# EAGLE design Board_V03 (EAGLE 9.3.0)
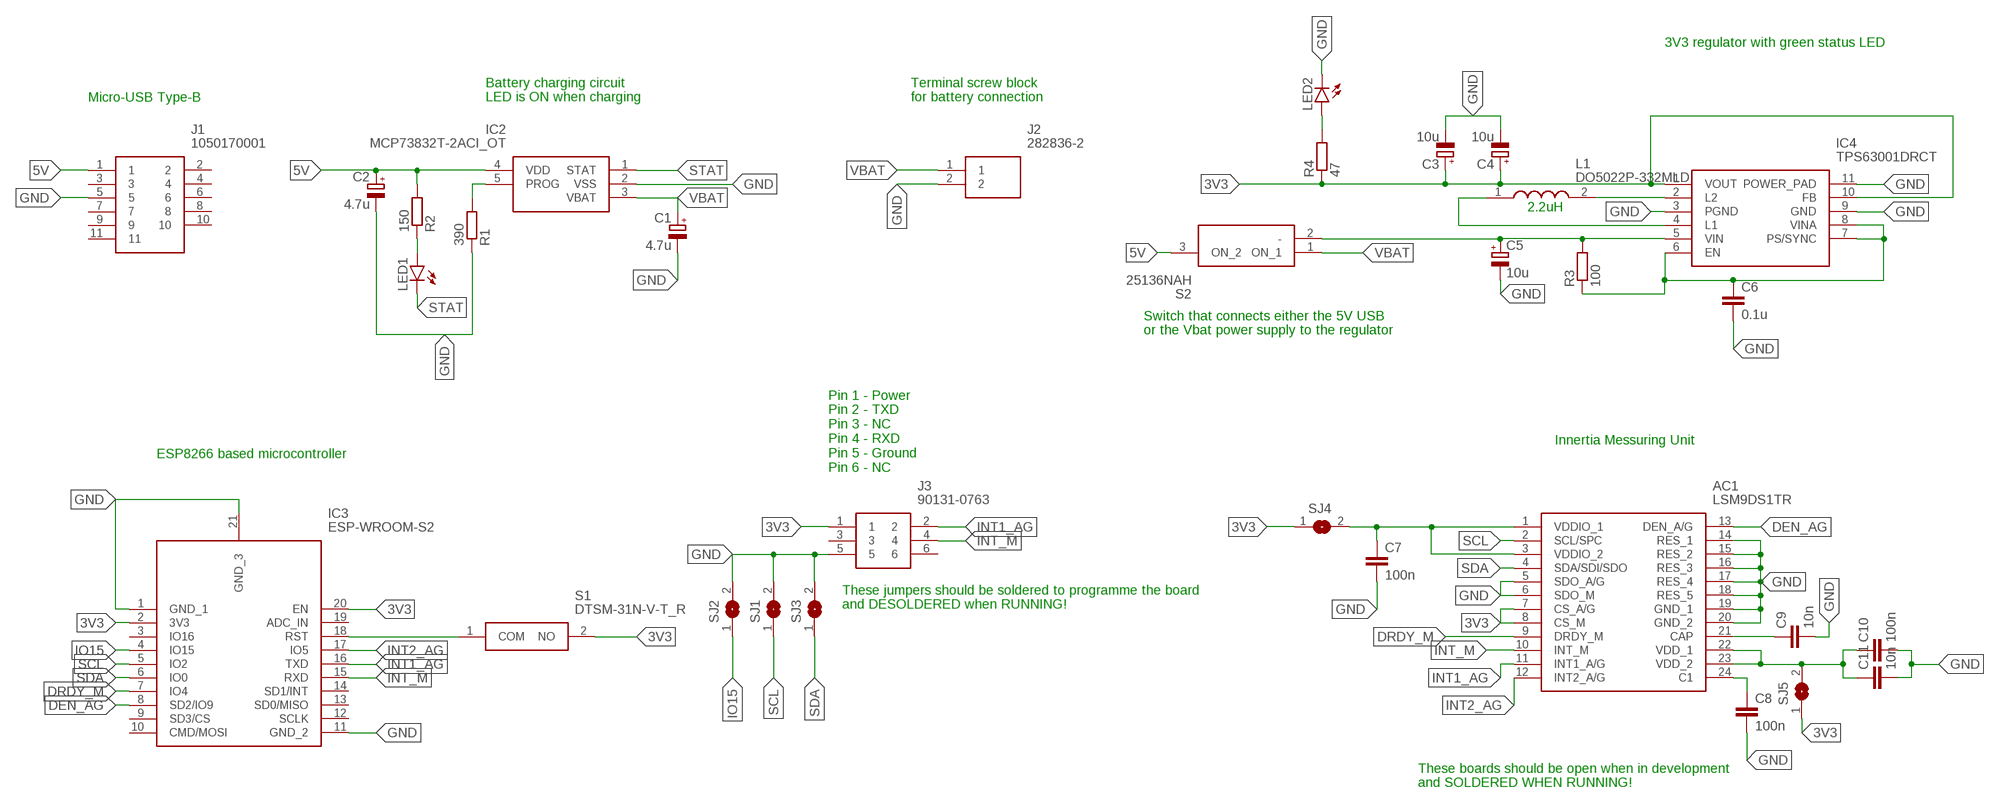
[diagram p0: schematic, sheet 1]

## Parts
AC1  LSM9DS1TR  [LGA-24L(3X3.5X1MM)]
C1  4.7u  CPOL-EUD/7343-31R  [D/7343-31R]
C2  4.7u  CPOL-EUD/7343-31R  [D/7343-31R]
C3  10u  CPOL-EUD/7343-31R  [D/7343-31R]
C4  10u  CPOL-EUD/7343-31R  [D/7343-31R]
C5  10u  CPOL-EUD/7343-31R  [D/7343-31R]
C6  0.1u  C-EUC0402  [C0402]
C7  100n  C-EUC0805  [C0805]
C8  100n  C-EUC0805  [C0805]
C9  10n  C-EUC0805  [C0805]
C10  100n  C-EUC0805  [C0805]
C11  10n  C-EUC0805  [C0805]
IC2  MCP73832T-2ACI_OT  [SOT95P270X145-5N]
IC3  ESP-WROOM-S2  [QFN150P1600X1700X315-21N]
IC4  TPS63001DRCT  [SON50P300X300X100-11N]
J1  1050170001  [MICROUSB-BTYPE]
J2  282836-2  [SHDR2W100P0X500_1X2_1000X820X1]
J3  90131-0763  [HDRV6W90P254_2X3_762X500X560P]
L1  DO5022P-332MLD  [DO5022P-104MLD]
LED1  LED5MM  [LED5MM]
LED2  LED5MM  [LED5MM]
R1  390  R-EU_R0805  [R0805]
R2  150  R-EU_R0805  [R0805]
R3  100  R-EU_R0805  [R0805]
R4  47  R-EU_R0805  [R0805]
S1  DTSM-31N-V-T_R  [DTSM32NVTR]
S2  25136NAH  [25136NAH]
SJ1  SJW  [SJW]
SJ2  SJW  [SJW]
SJ3  SJW  [SJW]
SJ4  SJW  [SJW]
SJ5  SJW  [SJW]

## Nets
3V3 [power]: AC1.7(CS_A/G) AC1.8(CS_M) C3.+ C4.+ IC3.2(3V3) IC3.20(EN) IC4.1(VOUT) IC4.10(FB) J3.1 R4.1 S1.2(NO) SJ4.1 SJ5.1
5V [power]: C2.+ IC2.4(VDD) J1.1 R2.2 S2.3(ON_2)
DEN_AG: AC1.13(DEN_A/G) IC3.8(SD2/IO9)
DRDY_M: AC1.9(DRDY_M) IC3.7(IO4)
GND [ground]: AC1.5(SDO_A/G) AC1.6(SDO_M) AC1.14(RES_1) AC1.15(RES_2) AC1.16(RES_3) AC1.17(RES_4) AC1.18(RES_5) AC1.19(GND_1) AC1.20(GND_2) C1.- C2.- C3.- C4.- C5.- C6.2 C7.2 C8.2 C9.2 C10.2 C11.2 IC2.2(VSS) IC3.1(GND_1) IC3.11(GND_2) IC3.21(GND_3) IC4.3(PGND) IC4.9(GND) IC4.11(POWER_PAD) J1.5 J2.2 J3.5 LED2.K(C) R1.1 SJ1.2 SJ2.2 SJ3.2
INT1_AG: AC1.11(INT1_A/G) IC3.16(TXD) J3.2
INT2_AG: AC1.12(INT2_A/G) IC3.17(IO5)
INT_M: AC1.10(INT_M) IC3.15(RXD) J3.4
IO15: IC3.4(IO15) SJ2.1
N$1: IC2.5(PROG) R1.2
N$2: LED1.A R2.1
N$3: AC1.21(CAP) C9.1
N$4: C5.+ IC4.5(VIN) R3.2 S2.2(-)
N$5: LED2.A R4.2
N$6: AC1.1(VDDIO_1) AC1.3(VDDIO_2) C7.1 SJ4.2
N$7: IC4.2(L2) L1.2
N$8 [thin]: IC4.4(L1) L1.1
N$9: AC1.22(VDD_1) AC1.23(VDD_2) C10.1 C11.1 SJ5.2
N$10: C6.1 IC4.6(EN) IC4.7(PS/SYNC) IC4.8(VINA) R3.1
N$11: AC1.24(C1) C8.1
N$12: IC3.18(RST) S1.1(COM)
SCL: AC1.2(SCL/SPC) IC3.5(IO2) SJ1.1
SDA: AC1.4(SDA/SDI/SDO) IC3.6(IO0) SJ3.1
STAT: IC2.1(STAT) LED1.K(C)
VBAT: C1.+ IC2.3(VBAT) J2.1 S2.1(ON_1)
Unconnected: IC3.3(IO16) IC3.9(SD3/CS) IC3.10(CMD/MOSI) IC3.12(SCLK) IC3.13(SD0/MISO) IC3.14(SD1/INT) IC3.19(ADC_IN) J1.2 J1.3 J1.4 J1.6 J1.7 J1.8 J1.9 J1.10 J1.11 J3.3 J3.6

## Notes on the sheet
- 3V3 regulator with green status LED
- Micro-USB Type-B
- Battery charging circuit
  LED is ON when charging
- Terminal screw block 
  for battery connection
- 2.2uH
- Switch that connects either the 5V USB
  or the Vbat power supply to the regulator
- Innertia Messuring Unit
- ESP8266 based microcontroller
- Pin 1 - Power
  Pin 2 - TXD
  Pin 3 - NC
  Pin 4 - RXD
  Pin 5 - Ground
  Pin 6 - NC
- These jumpers should be soldered to programme the board
  and DESOLDERED when RUNNING!
- These boards should be open when in development
  and SOLDERED WHEN RUNNING!

## Library data of the parts
AC1 = SamacSys_Parts:LSM9DS1TR: iNEMO Inertial 3D Accel/Gyro/Magn. LGA24 STMicroelectronics LSM9DS1TR 3-Axis Accelerometer, Gyroscope & Magnetometer, 0 400 kHz, 1.9 3.6 V Source: Datasheet <http://www.st.com/content/ccc/resource/technical/document/datasheet/1e/3f/2a/d6/25/eb/48/46/DM00103319.pdf/files/DM00103319.pdf/jcr:content/translations/en.DM00103319.pdf>; DESCRIPTION: iNEMO Inertial 3D Accel/Gyro/Magn. LGA24 STMicroelectronics LSM9DS1TR 3-Axis Accelerometer, Gyroscope & Magnetometer, 0 400 kHz, 1.9 3.6 V; HEIGHT: mm; MANUFACTURER_NAME: STMicroelectronics; MANUFACTURER_PART_NUMBER: LSM9DS1TR; MOUSER_PART_NUMBER: 511-LSM9DS1TR; MOUSER_PRICE-STOCK: https://www.mouser.com/Search/Refine.aspx?Keyword=511-LSM9DS1TR; RS_PART_NUMBER: 1660908; RS_PRICE-STOCK: http://uk.rs-online.com/web/p/products/1660908
C1-C5 = rcl:CPOL-EU: POLARIZED CAPACITOR, European symbol; SPICEPREFIX: C
C6-C11 = rcl:C-EU: CAPACITOR, European symbol; SPICEPREFIX: C
IC2 = SamacSys_Parts:MCP73832T-2ACI_OT: Battery Charger Lithium-Ion, Lithium-Polymer Source: Datasheet <http://docs-emea.rs-online.com/webdocs/1381/0900766b81381752.pdf>; ALLIED_NUMBER: 70046199; ALLIED_PRICE-STOCK: http://www.alliedelec.com/microchip-technology-inc-mcp73832t-2aci-ot/70046199/; DESCRIPTION: Battery Charger Lithium-Ion, Lithium-Polymer; HEIGHT: 1.45mm; MANUFACTURER_NAME: Microchip; MANUFACTURER_PART_NUMBER: MCP73832T-2ACI/OT; MOUSER_PART_NUMBER: 579-MCP73832T-2ACIOT; MOUSER_PRICE-STOCK: https://www.mouser.com/Search/Refine.aspx?Keyword=579-MCP73832T-2ACIOT; RS_PART_NUMBER: 9122897; RS_PRICE-STOCK: http://uk.rs-online.com/web/p/products/9122897
IC3 = SamacSys_Parts:ESP-WROOM-S2: WiFi Modules (802.11) ESP-WROOM-S2, SMD Module, ESP8266EX, 16Mbits SPI Flash, SPI Mode Source: Datasheet <https://docs-emea.rs-online.com/webdocs/15b7/0900766b815b7223.pdf>; DESCRIPTION: WiFi Modules (802.11) ESP-WROOM-S2, SMD Module, ESP8266EX, 16Mbits SPI Flash, SPI Mode; HEIGHT: 3.15mm; MANUFACTURER_NAME: Espressif Systems; MANUFACTURER_PART_NUMBER: ESP-WROOM-S2
IC4 = SamacSys_Parts:TPS63001DRCT: 96% Buck-Boost Converter with 1.7A Current Switches, 3.3V fixed Output voltage in 3x3 QFN Source: Datasheet <http://uk.rs-online.com/web/p/products/7968405>; DESCRIPTION: 96% Buck-Boost Converter with 1.7A Current Switches, 3.3V fixed Output voltage in 3x3 QFN; HEIGHT: mm; MANUFACTURER_NAME: Texas Instruments; MANUFACTURER_PART_NUMBER: TPS63001DRCT; RS_PART_NUMBER: 7968405
J1 = SamacSys_Parts:1050170001: USB Connectors MICRO USB B REC RA SMT BOT Source: Datasheet <http://www.mouser.com/ds/2/276/1050170001_IO_CONNECTORS-230168.pdf>; DESCRIPTION: USB Connectors MICRO USB B REC RA SMT BOT; HEIGHT: mm; MANUFACTURER_NAME: Molex; MANUFACTURER_PART_NUMBER: 1050170001; MOUSER_PART_NUMBER: N/A; MOUSER_PRICE-STOCK: https://www.mouser.com/Search/Refine.aspx?Keyword=N%2FA
J2 = SamacSys_Parts:282836-2: TERMINAL BLOCK, PCB MOUNT, SIDE WIRE ENTRY, STACKING , 5.00mm PITCH Source: Datasheet <http://www.te.com/commerce/DocumentDelivery/DDEController?Action=srchrtrv&DocNm=282836&DocType=Customer Drawing&DocLang=English>; ALLIED_NUMBER: 70086275; ALLIED_PRICE-STOCK: https://www.alliedelec.com/te-connectivity-282836-2/70086275/; DESCRIPTION: TERMINAL BLOCK, PCB MOUNT, SIDE WIRE ENTRY, STACKING , 5.00mm PITCH; HEIGHT: 10.2mm; MANUFACTURER_NAME: TE Connectivity; MANUFACTURER_PART_NUMBER: 282836-2; MOUSER_PART_NUMBER: 571-2828362; MOUSER_PRICE-STOCK: https://www.mouser.com/Search/Refine.aspx?Keyword=571-2828362; RS_PART_NUMBER: 1354983; RS_PRICE-STOCK: http://uk.rs-online.com/web/p/products/1354983
J3 = SamacSys_Parts:90131-0763: Molex C-GRID III 90131, 2.54mm Pitch, 6 Way, 2 Row, Straight Pin Header, Through Hole Source: Datasheet <https://www.molex.com/pdm_docs/sd/901310763_sd.pdf>; ALLIED_NUMBER: 70372847; ALLIED_PRICE-STOCK: https://www.alliedelec.com/molex-incorporated-90131-0763/70372847/; DESCRIPTION: Molex C-GRID III 90131, 2.54mm Pitch, 6 Way, 2 Row, Straight Pin Header, Through Hole; HEIGHT: 5.6mm; MANUFACTURER_NAME: Molex; MANUFACTURER_PART_NUMBER: 90131-0763; MOUSER_PART_NUMBER: 538-90131-0763; MOUSER_PRICE-STOCK: https://www.mouser.com/Search/Refine.aspx?Keyword=538-90131-0763; RS_PART_NUMBER: 3606443P; RS_PRICE-STOCK: http://uk.rs-online.com/web/p/products/3606443P
L1 = SamacSys_Parts:DO5022P-332MLD: Fixed Inductors DO5022P Pwr Inductor 3.3 uH 20 % 6.2 A Source: Datasheet <https://www.coilcraft.com/pdfs/do5022p.pdf>; DESCRIPTION: Fixed Inductors DO5022P Pwr Inductor 3.3 uH 20 % 6.2 A; HEIGHT: mm; MANUFACTURER_NAME: COILCRAFT; MANUFACTURER_PART_NUMBER: DO5022P-332MLD; MOUSER_PART_NUMBER: 994-DO5022P-332MLD; MOUSER_PRICE-STOCK: https://www.mouser.com/Search/Refine.aspx?Keyword=994-DO5022P-332MLD
LED1 LED2 = led:LED: LED OSRAM: - CHIPLED LG R971, LG N971, LY N971, LG Q971, LY Q971, LO R971, LY R971 LH N974, LH R974 LS Q976, LO Q976, LY Q976 LO Q996 - Hyper CHIPLED LW Q18S LB Q993, LB Q99A, LB R99A - SideLED LS A670, LO A670, LY A670, LG A670, LP A670 LB A673, LV A673, LT A673, LW A673 LH A674 LY A675 LS A676, LA A676, LO A676, LY A676, LW A676 LS A679, LY A679, LG A679 - Hyper Micro SIDELED® LS Y876, LA Y876, LO Y876, LY Y876 LT Y87S - SmartLED LW L88C, LW L88S LB L89C, LB L89S, LG L890 LS L89K, LO L89K, LY L89K LS L896, LA L896, LO L896, LY L896 - TOPLED LS T670, LO T670, LY T670, LG T670, LP T670 LSG T670, LSP T670, LSY T670, LOP T670, LYG T670 LG T671, LOG T671, LSG T671 LB T673, LV T673, LT T673, LW T673 LH T674 LS T676, LA T676, LO T676, LY T676, LB T676, LH T676, LSB T676, LW T676 LB T67C, LV T67C, LT T67C, LS T67K, LO T67K, LY T67K, LW E67C LS E67B, LA E67B, LO E67B, LY E67B, LB E67C, LV E67C, LT E67C LW T67C LS T679, LY T679, LG T679 LS T770, LO T770, LY T770, LG T770, LP T770 LB T773, LV T773, LT T773, LW T773 LH T774 LS E675, LA E675, LY E675, LS T675 LS T776, LA T776, LO T776, LY T776, LB T776 LHGB T686 LT T68C, LB T68C - Hyper Mini TOPLED® LB M676 - Mini TOPLED Santana® LG M470 LS M47K, LO M47K, LY M47K Source: http://www.osram.convergy.de LUXEON: - LUMILED® LXK2-PW12-R00, LXK2-PW12-S00, LXK2-PW14-U00, LXK2-PW14-V00 LXK2-PM12-R00, LXK2-PM12-S00, LXK2-PM14-U00 LXK2-PE12-Q00, LXK2-PE12-R00, LXK2-PE12-S00, LXK2-PE14-T00, LXK2-PE14-U00 LXK2-PB12-K00, LXK2-PB12-L00, LXK2-PB12-M00, LXK2-PB14-N00, LXK2-PB14-P00, LXK2-PB14-Q00 LXK2-PR12-L00, LXK2-PR12-M00, LXK2-PR14-Q00, LXK2-PR14-R00 LXK2-PD12-Q00, LXK2-PD12-R00, LXK2-PD12-S00 LXK2-PH12-R00, LXK2-PH12-S00 LXK2-PL12-P00, LXK2-PL12-Q00, LXK2-PL12-R00 Source: www.luxeon.com KINGBRIGHT: KA-3528ASYC Source: www.kingbright.com
R1-R4 = rcl:R-EU_: RESISTOR, European symbol; SPICEPREFIX: R
S1 = SamacSys_Parts:DTSM-31N-V-T_R: Tactile Switches SMT Type 3.5*6 Source: Datasheet <http://www.dip.com.tw/en/en-product-information/en-switch004/item/2444-dts-3-dtsm-l-3>; DESCRIPTION: Tactile Switches SMT Type 3.5*6; HEIGHT: 5mm; MANUFACTURER_NAME: Diptronics; MANUFACTURER_PART_NUMBER: DTSM-31N-V-T/R; MOUSER_PART_NUMBER: 113-DTSM31NVTR; MOUSER_PRICE-STOCK: https://www.mouser.com/Search/Refine.aspx?Keyword=113-DTSM31NVTR
S2 = SamacSys_Parts:25136NAH: PCB Slide Switch SPDT On-On 4 A@ 125 V ac Slide Source: Datasheet <https://www.apem.com/int/index.php?controller=attachment&id_attachment=858>; DESCRIPTION: PCB Slide Switch SPDT On-On 4 A@ 125 V ac Slide; HEIGHT: 8mm; MANUFACTURER_NAME: Apem; MANUFACTURER_PART_NUMBER: 25136NAH; MOUSER_PART_NUMBER: 642-25136NAH; MOUSER_PRICE-STOCK: https://www.mouser.com/Search/Refine.aspx?Keyword=642-25136NAH; RS_PART_NUMBER: 0339673A; RS_PRICE-STOCK: http://uk.rs-online.com/web/p/products/0339673A
SJ1-SJ5 = jumper:SJ: SMD solder JUMPER

## Net classes
0 default: width 0.406 mm, clearance 0.205 mm
1 ground: width 0.61 mm, clearance 0.205 mm to class 0, clearance 0.205 mm
2 power: width 0.508 mm, clearance 0.205 mm to class 0, clearance 0.205 mm to class 1, clearance 0.205 mm
3 thin: width 0.305 mm, clearance 0.205 mm to class 0, clearance 0.205 mm to class 1, clearance 0.205 mm to class 2, clearance 0.205 mm

## Board
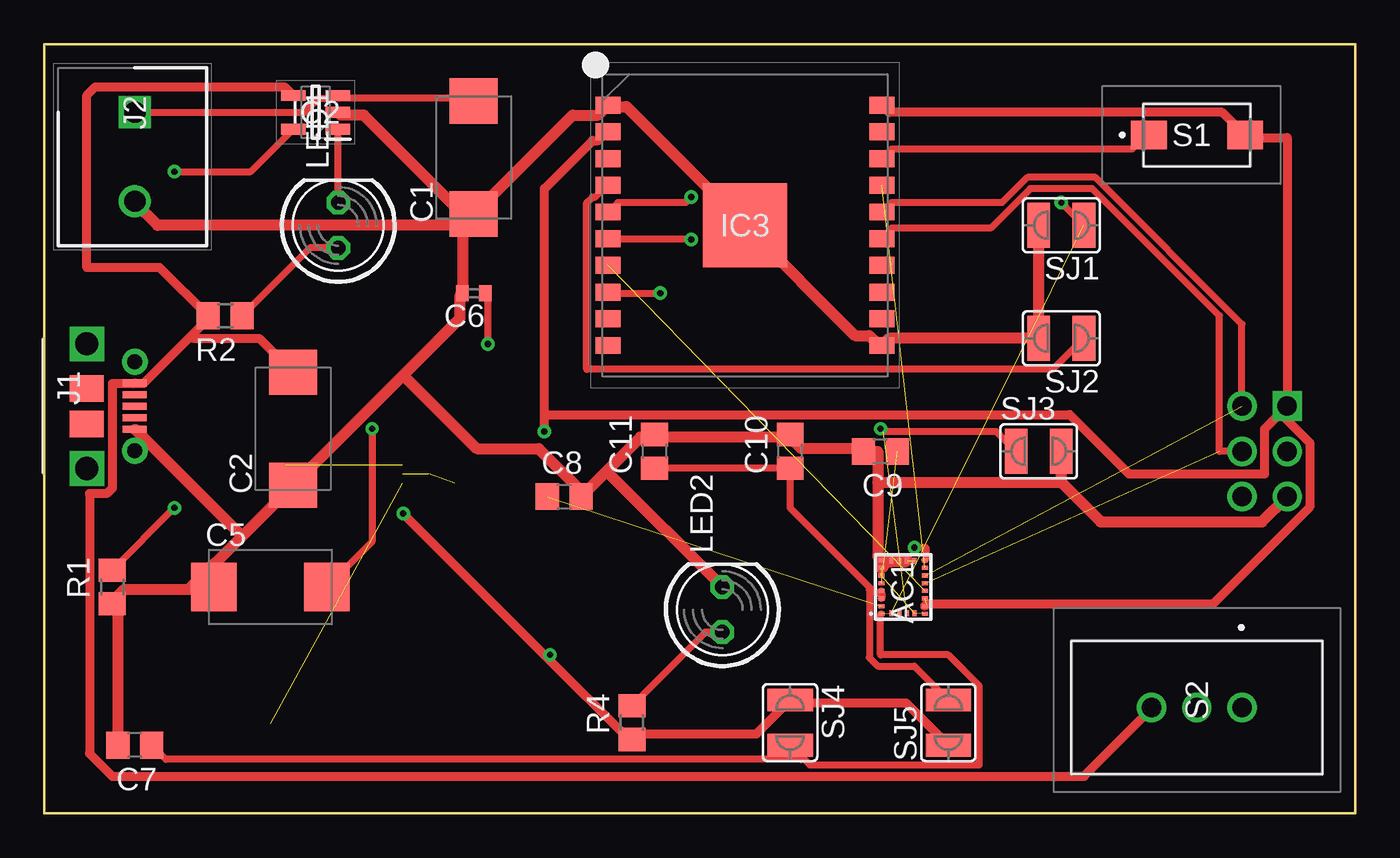
[diagram p1: board, top side]
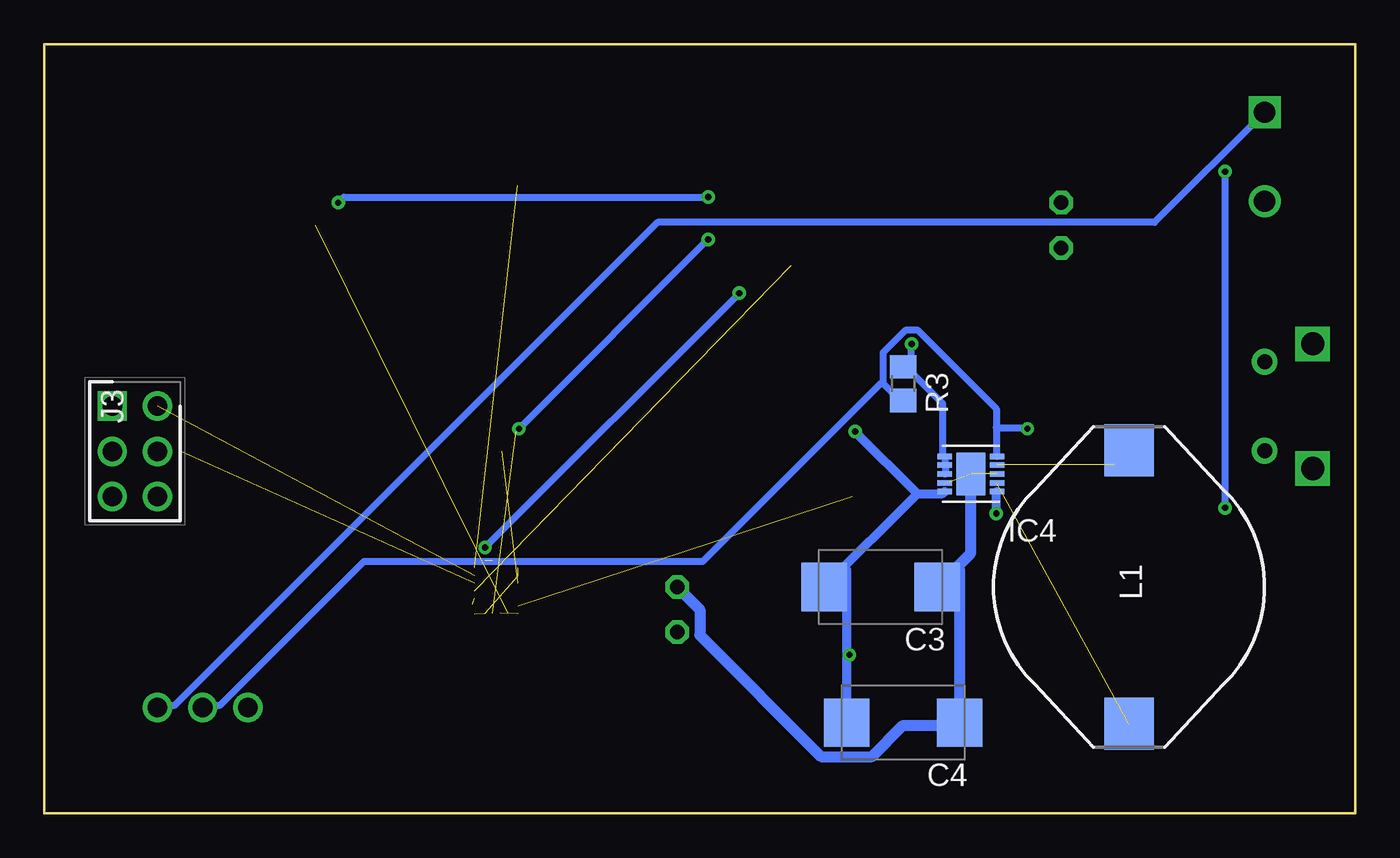
[diagram p2: board, bottom side, seen from below]

Size 73.66 x 43.18 mm. Coordinates in mm from the lower left corner, seen from the top.
Outline: 0,0 0,43.18 73.66,43.18 73.66,0 0,0
Copper layers (1*16): Top 0.035mm / dielectric 1.5mm / Bottom 0.035mm
Design rules "default": minimum track width 6mil, minimum drill 0.35mm, track to track 6mil, track to pad 6mil, pad to pad 6mil, via to via 6mil, smd to smd 6mil, copper to edge 40mil, drill to drill 6mil, minimum pad ring 10mil, minimum via ring 8mil, stop-mask expansion 4mil, vias tented up to drill 0mil, thermal gap 10mil

### Footprints (pad centres in the part's own frame; a part is rotated, then mirrored left to right if it is on the bottom)
LGA-24L(3X3.5X1MM) = smd 0.23 x 0.35: 1 -1.505,1.225; 6 -1.505,-1.225; 7 -1.075,-1.225; 8 -0.645,-1.225; 9 -0.215,-1.225; 10 0.215,-1.225; 11 0.645,-1.225; 12 1.075,-1.225; 13 1.505,-1.225; 18 1.505,1.225; 19 1.075,1.225; 20 0.645,1.225; 21 0.215,1.225; 22 -0.215,1.225; 23 -0.645,1.225; 24 -1.075,1.225 | smd 0.35 x 0.23: 2 -1.475,0.645; 3 -1.475,0.215; 4 -1.475,-0.215; 5 -1.475,-0.645; 14 1.475,-0.645; 15 1.475,-0.215; 16 1.475,0.215; 17 1.475,0.645
D/7343-31R = smd 2.55 x 2.7: + 3.175,0; - -3.175,0
C0402 = smd 0.7 x 0.9: 1 -0.65,0; 2 0.65,0
C0805 = smd 1.3 x 1.5: 1 -0.95,0; 2 0.95,0
SOT95P270X145-5N = smd 1.4 x 0.6: 1 -1.25,0.95; 2 -1.25,0; 3 -1.25,-0.95; 4 1.25,-0.95; 5 1.25,0.95
QFN150P1600X1700X315-21N = smd 1.4 x 0.95: 1 -7.7,6.75; 2 -7.7,5.25; 3 -7.7,3.75; 4 -7.7,2.25; 5 -7.7,0.75; 6 -7.7,-0.75; 7 -7.7,-2.25; 8 -7.7,-3.75; 9 -7.7,-5.25; 10 -7.7,-6.75; 11 7.7,-6.75; 12 7.7,-5.25; 13 7.7,-3.75; 14 7.7,-2.25; 15 7.7,-0.75; 16 7.7,0.75; 17 7.7,2.25; 18 7.7,3.75; 19 7.7,5.25; 20 7.7,6.75 | smd 4.7 x 4.7: 21 0,0
SON50P300X300X100-11N = smd 0.813 x 0.305: 1 -1.473,0.991; 2 -1.473,0.508; 3 -1.473,0; 4 -1.473,-0.508; 5 -1.473,-0.991; 6 1.473,-0.991; 7 1.473,-0.508; 8 1.473,0; 9 1.473,0.508; 10 1.473,0.991 | smd 1.651 x 2.388: 11 0,0
MICROUSB-BTYPE = smd 0.4 x 1.35: 1 -1.3,0; 2 -0.65,0; 3 0,0; 4 0.65,0; 5 1.3,0 | drill 0.85 pad 1.45: 6 -2.5,0; 7 2.5,0 | drill 1.3 pad 1.9 square: 8 -3.5,-2.7; 9 3.5,-2.7 | smd 1.5 x 1.9: 10 -1,-2.7; 11 1,-2.7
SHDR2W100P0X500_1X2_1000X820X1 = drill 1.2 pad 1.8 square: 1 0,0 | drill 1.2 pad 1.8: 2 5,0
HDRV6W90P254_2X3_762X500X560P = drill 1.1 pad 1.65 square: 1 0,0 | drill 1.1 pad 1.65: 2 0,2.54; 3 2.54,0; 4 2.54,2.54; 5 5.08,0; 6 5.08,2.54
DO5022P-104MLD = smd 2.92 x 2.79: 1 -7.685,0; 2 7.685,0
LED5MM = drill 0.813 octagon: A -1.27,0; K 1.27,0
R0805 = smd 1.3 x 1.5: 1 -0.95,0; 2 0.95,0
DTSM32NVTR = smd 2 x 1.6: 1 -2.7,0; 2 2.7,0
25136NAH = drill 1.1 pad 1.65: 1 -0.425,-2.54; 2 -0.425,0; 3 -0.425,2.54
SJW = smd 1.27 x 2.54: 1 -1.27,0; 2 1.27,0

### Placement (x,y rotation side)
AC1  48.26,12.7 90 top
C1  24.13,36.83 90 top
C2  13.97,21.59 90 top
C3  26.67,12.7 180 bottom
C4  25.4,5.08 180 bottom
C5  12.7,12.7 0 top
C6  24.13,29.21 180 top
C7  5.08,3.81 180 top
C8  29.21,17.78 0 top
C9  46.99,20.32 180 top
C10  41.91,20.32 90 top
C11  34.29,20.32 90 top
IC2  15.24,39.37 180 top
IC3  39.37,33.02 0 top
IC4  21.59,19.05 180 bottom
J1  5.08,22.86 270 top
J2  5.08,39.37 270 top
J3  69.85,22.86 270 bottom
L1  12.7,12.7 270 bottom
LED1  16.51,33.02 90 top
LED2  38.1,11.43 90 top
R1  3.81,12.7 90 top
R2  10.16,27.94 180 top
R3  25.4,24.13 270 bottom
R4  33.02,5.08 90 top
S1  64.77,38.1 0 top
S2  64.77,6.35 90 top
SJ1  57.15,33.02 180 top
SJ2  57.15,26.67 180 top
SJ3  55.88,20.32 0 top
SJ4  41.91,5.08 270 top
SJ5  50.8,5.08 90 top

### Tracks (layer width: path | path; a pad name or v marks a point on that pad's centre or on a via)
3V3  (via drill 0.35)  (1 unrouted)
  Top 0.508: IC3.20 47.15,39.69 47.47,39.37 66.2,39.37 S1.2 67.63,37.94 69.85,37.94 J3.1 | v28.1,21.43 28.1,22.38 | 28.1,22.38 28.1,35.08 30.8,37.78 31.11,37.78 31.59,38.26 IC3.2 | 28.26,8.73 32.7,4.29 33.02,4.29 R4.1 33.18,4.45 40.01,4.45 SJ4.1 42.07,6.19 48.42,6.19 SJ5.1 | 28.26,8.73 v20.16,16.83 | v28.42,8.89 28.26,8.73 | J3.1 68.58,21.59 68.58,19.05 60.96,19.05 57.63,22.38 28.1,22.38 | AC1.7 49.59,11.73 65.66,11.73 71.11,17.18 71.11,20.82 69.57,22.35 J3.1
  Bottom 0.508: 24.61,17.94 23.18,17.94 IC4.10 | 24.61,17.94 C3.+ 28.57,13.65 28.57,8.89 | 24.61,17.94 v28.1,21.43 | 28.57,8.89 C4.+ | v20.16,16.83 20.16,17.94 IC4.1 | v28.42,8.89 28.57,8.89
5V
  Top 0.508: 8.26,26.83 9.37,27.94 R2.2 6.47,30.64 2.38,30.64 2.38,40.32 2.86,40.8 13.49,40.8 13.97,40.32 IC2.4 | 8.26,26.83 5.56,24.13 5.08,24.13 J1.1 4.92,24.13 3.81,24.13 3.81,18.26 3.49,17.94 2.54,17.94 2.54,3.33 3.81,2.06 58.42,2.06 62.23,5.87 S2.3 | C2.+ 12.06,26.67 8.41,26.67 8.26,26.83
DEN_AG  (via drill 0.35)
  Top 0.406: v48.9,14.92 49.53,14.92 49.53,14.29 AC1.13 | v34.61,29.21 31.75,29.21 IC3.8
  Bottom 0.406: v34.61,29.21 v48.9,14.92
DRDY_M  (1 unrouted)
GND  (6 unrouted)
  Top 0.61: 31.59,19.21 33.5,21.11 34.29,21.11 C11.2 34.45,21.11 41.75,21.11 C10.2 41.91,21.11 42.55,20.48 45.88,20.48 C9.2 46.83,20.32 46.83,18.57 | 31.59,19.21 C8.2 30.16,18.1 27.78,20.48 24.29,20.48 20.16,24.61 | 31.59,19.21 LED2.K | 47.15,14.13 47.15,13.81 AC1.19 | 47.15,14.13 AC1.18 46.83,14.45 46.83,18.57 | 47.15,14.13 47.62,14.13 | 47.62,14.13 AC1.17 | 47.62,14.13 47.94,14.13 AC1.16 48.26,14.13 48.42,14.13 AC1.15 | 57.15,18.57 SJ3.2 | 46.83,18.57 57.15,18.57 | J3.5 68.42,16.35 59.37,16.35 57.15,18.57 | C7.2 4.13,11.59 3.97,11.59 R1.1 3.81,11.91 4.45,12.54 9.37,12.54 C5.- 8.26,12.7 11.11,15.56 | 11.11,15.56 C2.- 20.16,24.61 | SJ1.2 SJ2.2 47.47,26.67 47.15,26.35 IC3.11 46.83,26.35 46.35,26.83 45.56,26.83 IC3.21 32.7,39.69 31.91,39.69 IC3.1 31.59,39.69 31.11,39.21 29.69,39.21 C1.- | C1.- 23.5,33.66 23.5,29.21 C6.2 23.34,29.05 23.34,27.78 20.16,24.61 | IC2.2 16.51,39.37 16.67,39.21 17.94,39.21 23.34,33.81 C1.- | J2.2 5.08,34.29 6.35,33.02 23.34,33.02 C1.- | J1.5 5.11,21.56 11.11,15.56
  Bottom 0.61: IC4.11 21.59,14.61 C3.- 22.23,13.65 C4.- 22.38,4.92 25.4,4.92 27.15,3.17 30,3.17 36.83,10 36.83,11.43 LED2.K
INT1_AG  (1 unrouted)
  Top 0.406: J3.2 67.31,27.46 59.05,35.72 55.24,35.72 53.82,34.29 47.62,34.29 47.15,33.81 IC3.16
INT2_AG  (1 unrouted)
INT_M  (1 unrouted)
  Top 0.406: J3.4 66.04,20.32 66.04,27.94 58.9,35.08 55.4,35.08 53.18,32.86 47.62,32.86 47.15,32.38 IC3.15
IO15
  Top 0.406: SJ2.1 56.67,24.92 30.48,24.92 30.48,34.29 30.8,34.61 30.96,34.61 31.59,35.24 IC3.4
N$1  (via drill 0.35)
  Top 0.406: v7.3,36.04 11.59,36.04 13.97,38.42 IC2.5 | v7.3,17.14 R1.2
  Bottom 0.406: v7.3,17.14 v7.3,36.04
N$2
  Top 0.406: LED1.A 14.92,31.75 R2.1
N$3  (1 unrouted)
N$4  (via drill 0.35)
  Top 0.406: v18.41,21.59 18.41,15.24 C5.+
  Bottom 0.406: 20.16,21.65 20.16,22.7 24.61,27.15 25.24,27.15 26.51,25.88 26.51,24.13 | 20.16,21.65 20.16,20.16 IC4.5 | 26.51,24.13 25.72,23.34 25.4,23.34 R3.2 | S2.2 64.77,6.03 63.82,6.03 55.72,14.13 36.67,14.13 26.67,24.13 26.51,24.13 | 20.16,21.65 18.44,21.65 v18.41,21.59
N$5
  Top 0.406: LED2.A 37.15,10.16 R4.2
N$6  (1 unrouted)
  Top 0.406: SJ4.2 42.62,3.1 | 42.62,3.1 43.02,2.7 52.55,2.7 52.55,7.14 50.8,8.89 46.99,8.89 46.99,11.11 AC1.1 | C7.1 6.83,3.02 42.55,3.02 42.62,3.1
N$7  (1 unrouted)
N$8  (1 unrouted)
  Bottom 0.61: L1.1 13.53,19.56
N$9
  Top 0.406: 46.99,12.38 46.67,12.38 46.43,12.62 | 46.43,12.62 41.91,17.14 C10.1 41.75,19.37 C11.1 | 46.99,12.38 AC1.22 | SJ5.2 48.9,8.26 46.83,8.26 46.35,8.73 46.35,12.54 46.43,12.62 | AC1.23 47.08,12.15 47.08,12.29 46.99,12.38
N$10  (via drill 0.35)
  Top 0.406: v24.92,26.35 24.92,29.21 C6.1
  Bottom 0.406: IC4.8 23.02,19.05 23.02,19.53 IC4.7 23.02,19.68 23.02,20 IC4.6 23.18,20.16 23.18,23.02 25.24,25.08 R3.1 24.92,25.56 v24.92,26.35
N$11  (1 unrouted)
N$12
  Top 0.406: IC3.18 47.15,36.83 47.62,37.31 61.12,37.31 61.91,38.1 S1.1
SCL  (via drill 0.35)  (1 unrouted)
  Top 0.406: v36.35,34.61 36.04,34.29 32.23,34.29 31.75,33.81 IC3.5 | SJ1.1 v57.15,34.29
  Bottom 0.406: v36.35,34.61 56.83,34.61 v57.15,34.29
SDA  (via drill 0.35)  (1 unrouted)
  Top 0.406: v36.35,32.23 31.75,32.23 IC3.6 | v46.99,21.59 47.15,21.43 53.5,21.43 SJ3.1
  Bottom 0.406: v46.99,21.59 v36.35,32.23
STAT
  Top 0.406: LED1.K 16.51,38.42 IC2.1
VBAT
  Top 0.406: C1.+ 23.97,40.16 16.51,40.16 IC2.3 16.35,40.16 15.4,40.16 14.61,39.37 J2.1
  Bottom 0.406: J2.1 11.27,33.18 39.21,33.18 66.36,6.03 67.31,6.03 S2.1